# Altium schematic sheet Control_Circuit.SchDoc
size A3; DocumentNumber: 2; SheetNumber: 2; SheetTotal: 3
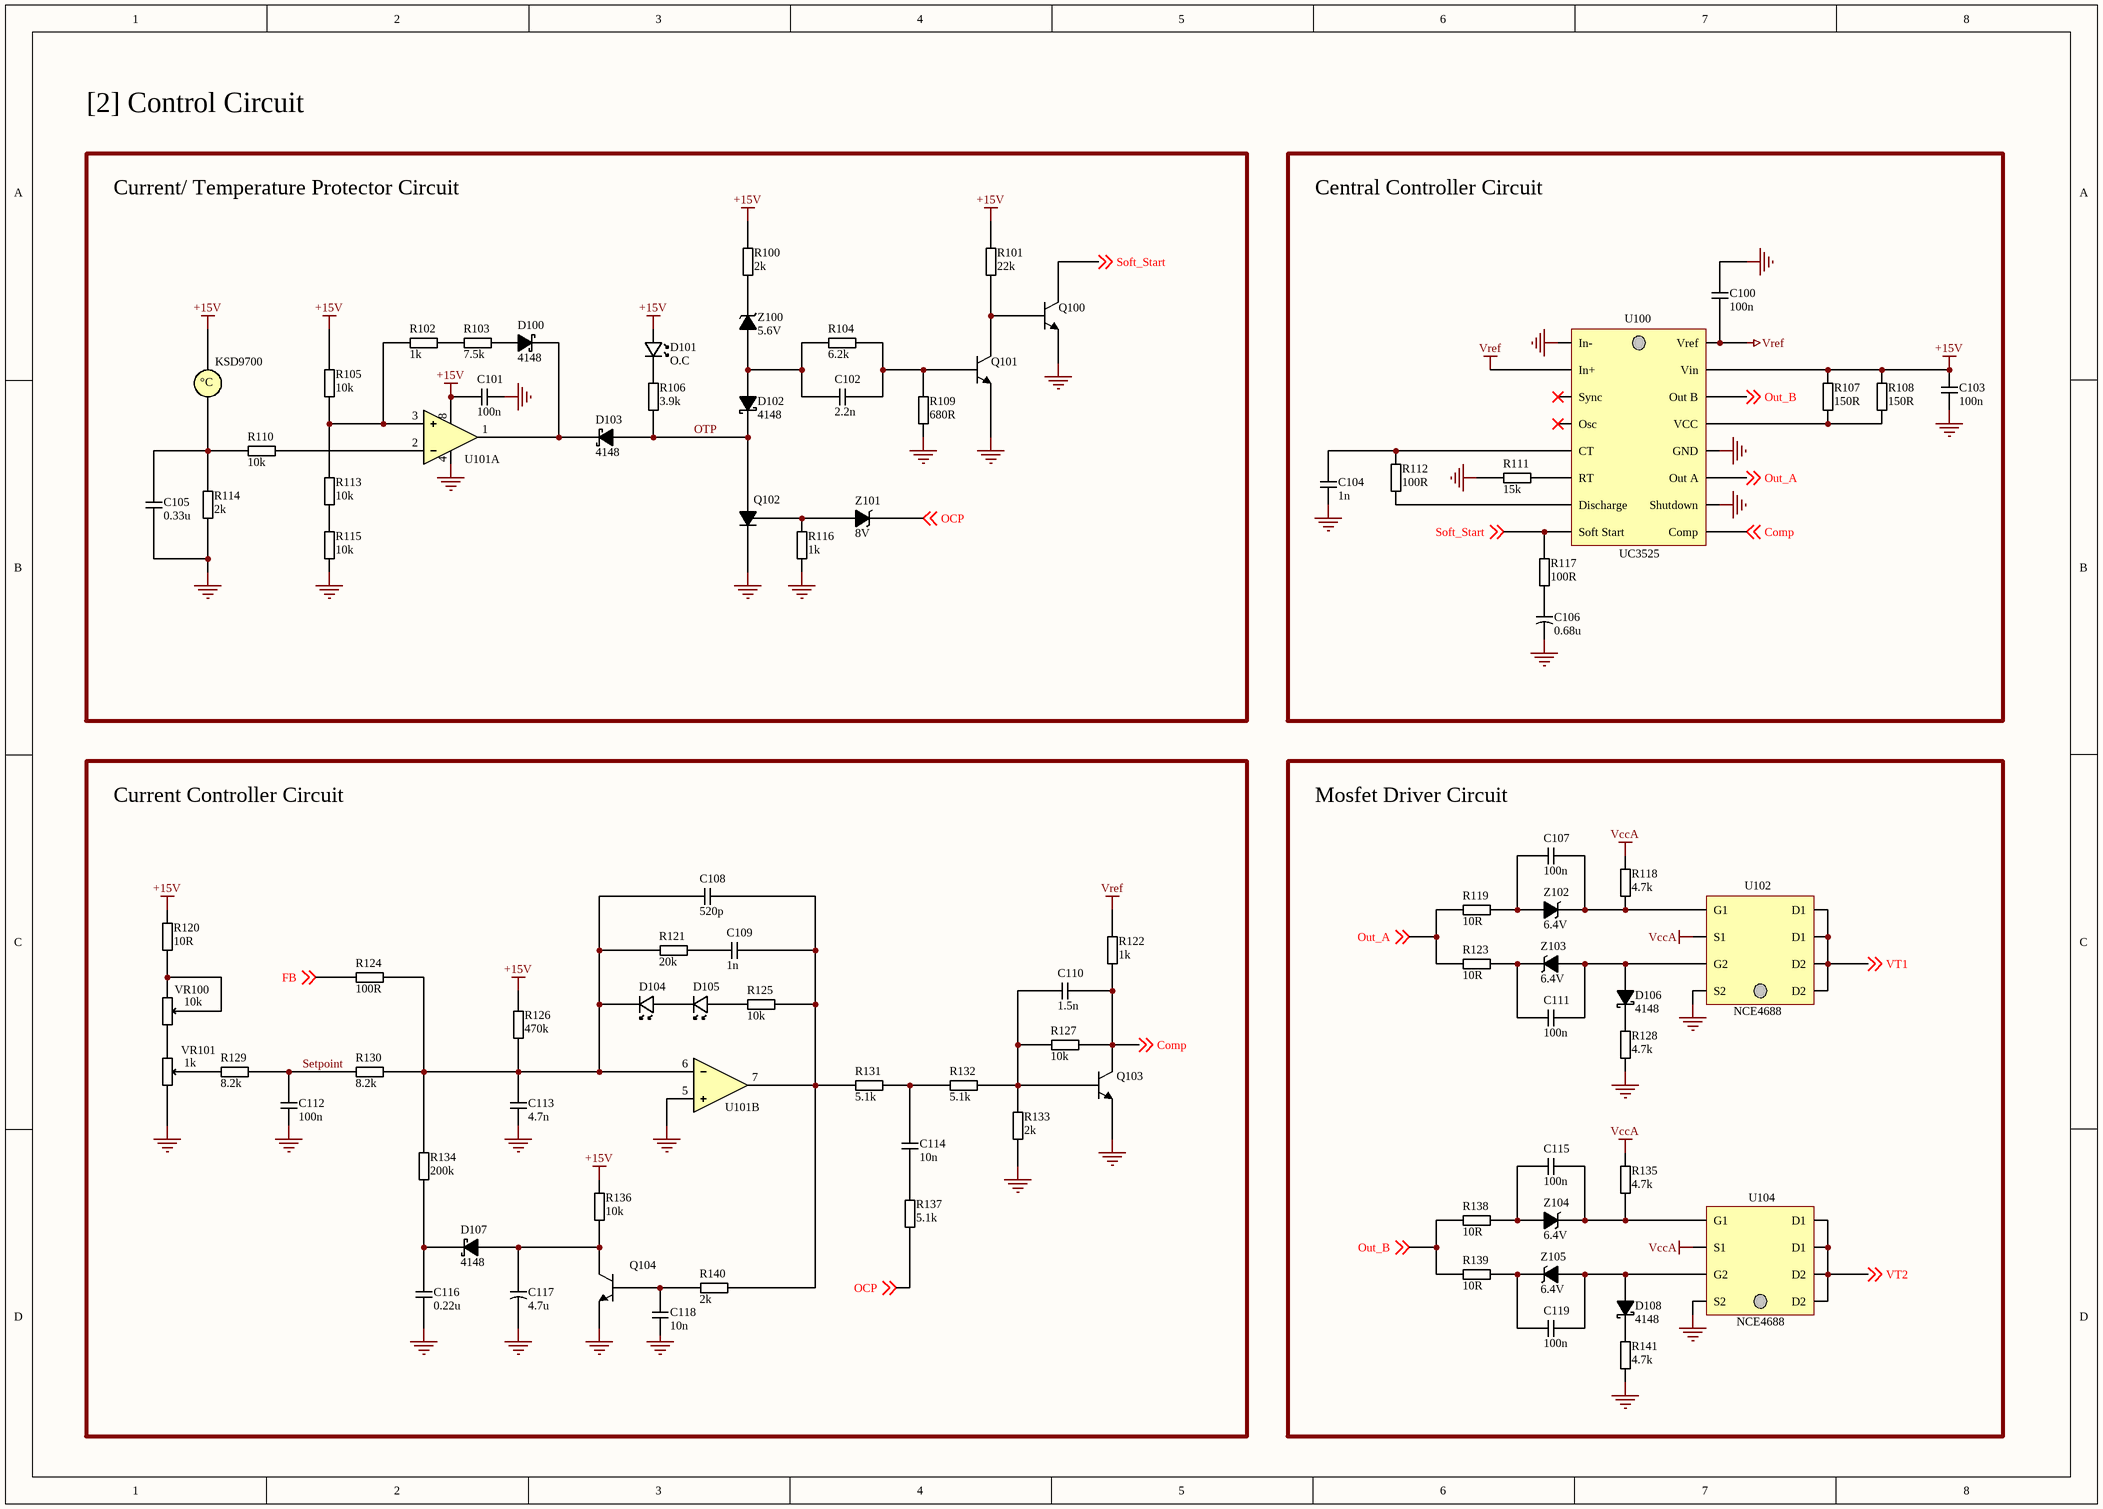
[diagram p0: Control_Circuit.SchDoc]

## Parts
C100  100n  [Cap_SMD_0805]
C101  100n  [Cap_SMD_0805]
C102  2.2n  [Cap_SMD_0805]
C103  100n  [Cap_SMD_0805]
C104  1n  [Cap_SMD_0805]
C105  0.33u  [Cap_SMD_0805]
C106  0.68u  [Cap_THD_Tantalum_2.5mm]
C107  100n  [Cap_SMD_0805]
C108  520p  [Cap_SMD_0805]
C109  1n  [Cap_SMD_0805]
C110  1.5n  [Cap_SMD_0805]
C111  100n  [Cap_SMD_0805]
C112  100n  [Cap_SMD_0805]
C113  4.7n  [Cap_SMD_0805]
C114  10n  [Cap_SMD_0805]
C115  100n  [Cap_SMD_0805]
C116  0.22u  [Cap_SMD_0805]
C117  4.7u  [Cap_THD_Tantalum_2.5mm]
C118  10n  [Cap_SMD_0805]
C119  100n  [Cap_SMD_0805]
D100  4148  [Diode_SMD_4.8mm]
D101  O.C  [Led_SMD_0805]
D102  4148  [Diode_SMD_4.8mm]
D103  4148  [Diode_SMD_4.8mm]
D104  D  [Led_SMD_0805]  (value not drawn)
D105  D  [Led_SMD_0805]  (value not drawn)
D106  4148  [Diode_SMD_4.8mm]
D107  4148  [Diode_SMD_4.8mm]
D108  4148  [Diode_SMD_4.8mm]
K100  KSD9700  [CONN_XH_2P_2.5mm]
Q100  8050  [SOT23 - 2mm]  (value not drawn)
Q101  8050  [SOT23 - 2mm]  (value not drawn)
Q102  MCR100-6  [SOT23 - 2mm]  (value not drawn)
Q103  8050  [SOT23 - 2mm]  (value not drawn)
Q104  8050  [SOT23 - 2mm]  (value not drawn)
R100  2k  [Res_SMD_0805]
R101  22k  [Res_SMD_0805]
R102  1k  [Res_SMD_0805]
R103  7.5k  [Res_SMD_0805]
R104  6.2k  [Res_SMD_0805]
R105  10k  [Res_SMD_0805]
R106  3.9k  [Res_SMD_0805]
R107  150R  [Res_SMD_0805]
R108  150R  [Res_SMD_0805]
R109  680R  [Res_SMD_0805]
R110  10k  [Res_SMD_0805]
R111  15k  [Res_SMD_0805]
R112  100R  [Res_SMD_0805]
R113  10k  [Res_SMD_0805]
R114  2k  [Res_SMD_0805]
R115  10k  [Res_SMD_0805]
R116  1k  [Res_SMD_0805]
R117  100R  [Res_SMD_0805]
R118  4.7k  [Res_SMD_0805]
R119  10R  [Res_SMD_0805]
R120  10R  [Res_SMD_0805]
R121  20k  [Res_SMD_0805]
R122  1k  [Res_SMD_0805]
R123  10R  [Res_SMD_0805]
R124  100R  [Res_SMD_0805]
R125  10k  [Res_SMD_0805]
R126  470k  [Res_SMD_0805]
R127  10k  [Res_SMD_0805]
R128  4.7k  [Res_SMD_0805]
R129  8.2k  [Res_SMD_0805]
R130  8.2k  [Res_SMD_0805]
R131  5.1k  [Res_SMD_0805]
R132  5.1k  [Res_SMD_0805]
R133  2k  [Res_SMD_0805]
R134  200k  [Res_SMD_0805]
R135  4.7k  [Res_SMD_0805]
R136  10k  [Res_SMD_0805]
R137  5.1k  [Res_SMD_0805]
R138  10R  [Res_SMD_0805]
R139  10R  [Res_SMD_0805]
R140  2k  [Res_SMD_0805]
R141  4.7k  [Res_SMD_0805]
U100  UC3525  [SOP16]
U101  OPAMP_LM358_V1  [SOP8]  (value not drawn)  (parts A,B of 2)
U102  NCE4688  [SOP8]
U104  NCE4688  [SOP8]
VR100  10k  [Trimmer_2.54mm]
VR101  1k  [Trimmer_2.54mm]
Z100  5.6V  [Diode_SMD_4.8mm]
Z101  8V  [Diode_SMD_4.8mm]
Z102  6.4V  [Diode_SMD_4.8mm]
Z103  6.4V  [Diode_SMD_4.8mm]
Z104  6.4V  [Diode_SMD_4.8mm]
Z105  6.4V  [Diode_SMD_4.8mm]

## Blocks framed on the sheet
Current/ Temperature Protector Circuit: C101 C102 C105 D100-D103 K100 Q100-Q102 R100-R106 R109 R110 R113-R116 U101 Z100 Z101
Central Controller Circuit: C100 C103 C104 C106 R107 R108 R111 R112 R117 U100
Current Controller Circuit: C108-C110 C112-C114 C116-C118 D104 D105 D107 Q103 Q104 R120-R122 R124-R127 R129-R134 R136 R137 R140 U101 VR100 VR101
Mosfet Driver Circuit: C107 C111 C115 C119 D106 D108 R118 R119 R123 R128 R135 R138 R139 R141 U102 U104 Z102-Z105

## Nets
+15V: C101.2 C103.2 D101.1(A) K100.1 R100.2 R101.2 R105.1 R107.2 R108.2 R120.2 R126.2 R136.2 U100.15(Vin) U101.8(V+)
GND: C100.2 C101.1 C103.1 C104.1 C105.2 C106.2(-) C112.2 C113.2 C116.2 C117.2(-) C118.2 Q100.1(E) Q101.1(E) Q102.2(K) Q103.1(E) Q104.1(E) R109.1 R111.1 R114.1 R115.2 R116.1 R128.2 R133.2 R141.2 U100.1(In-) U100.10(Shutdown) U100.12(GND) U101.4(V-) U101.5(In2+) U102.1(S2) U104.1(S2) VR101.3
VccA: R118.2 R135.1 U102.3(S1) U104.3(S1)
Vref: C100.1 R122.2 U100.2(In+) U100.16(Vref)
Comp: C110.1 Q103.3(C) R122.1 R127.1 U100.9(Comp) ; off-sheet Comp
FB: R124.2 ; off-sheet FB
OCP: R137.1 Z101.2(K) ; off-sheet OCP
OTP: D102.2(K) D103.1(A) Q102.1(A) R106.2
Out_A: R119.1 R123.1 U100.11(Out_A) ; off-sheet Out_A
Out_B: R138.1 R139.1 U100.14(Out_B) ; off-sheet Out_B
Setpoint: C112.1 R129.1 R130.2
Soft_Start: Q100.3(C) R117.2 U100.8(Soft_Start) ; off-sheet Soft_Start
VT1: U102.5(D1) U102.6(D1) U102.7(D2) U102.8(D2) ; off-sheet VT1
VT2: U104.5(D1) U104.6(D1) U104.7(D2) U104.8(D2) ; off-sheet VT2
NetC102_1: C102.1 Q101.2(B) R104.1 R109.2
NetC102_2: C102.2 D102.1(A) R104.2 Z100.1(A)
NetC104_2: C104.2 R112.2 U100.5(CT)
NetC105_1: C105.1 K100.2 R110.1 R114.2
NetC106_1: C106.1(+) R117.1
NetC107_1: C107.1 R118.1 U102.4(G1) Z102.2(K)
NetC107_2: C107.2 R119.2 Z102.1(A)
NetC108_1: C108.1 C109.1 R125.2 R131.1 R140.1 U101.7(Out2)
NetC108_2: C108.2 C113.1 D104.1(K) R121.1 R124.1 R126.1 R130.1 R134.2 U101.6(In2-)
NetC109_2: C109.2 R121.2
NetC110_2: C110.2 Q103.2(B) R127.2 R132.2 R133.1
NetC111_1: C111.1 D106.1(A) U102.2(G2) Z103.1(A)
NetC111_2: C111.2 R123.2 Z103.2(K)
NetC114_1: C114.1 R137.2
NetC114_2: C114.2 R131.2 R132.1
NetC115_1: C115.1 R135.2 U104.4(G1) Z104.2(K)
NetC115_2: C115.2 R138.2 Z104.1(A)
NetC116_1: C116.1 D107.2(K) R134.1
NetC117_1: C117.1(+) D107.1(A) Q104.3(C) R136.1
NetC118_1: C118.1 Q104.2(B) R140.2
NetC119_1: C119.1 D108.1(A) U104.2(G2) Z105.1(A)
NetC119_2: C119.2 R139.2 Z105.2(K)
NetD100_1: D100.1(A) R103.2
NetD100_2: D100.2(K) D103.2(K) U101.1(Out1)
NetD101_2: D101.2(K) R106.1
NetD104_2: D104.2(A) D105.1(K)
NetD105_2: D105.2(A) R125.1
NetD106_2: D106.2(K) R128.1
NetD108_2: D108.2(K) R141.1
NetQ100_2: Q100.2(B) Q101.3(C) R101.1
NetQ102_3: Q102.3(G) R116.2 Z101.1(A)
NetR100_1: R100.1 Z100.2(K)
NetR102_1: R102.1 R105.2 R113.1 U101.3(In1+)
NetR102_2: R102.2 R103.1
NetR107_1: R107.1 R108.1 U100.13(VCC)
NetR110_2: R110.2 U101.2(In1-)
NetR111_2: R111.2 U100.6(RT)
NetR112_1: R112.1 U100.7(Discharge)
NetR113_2: R113.2 R115.1
NetR120_1: R120.1 VR100.1 VR100.2
NetR129_2: R129.2 VR101.2
NetVR100_3: VR100.3 VR101.1

Not connected (* = marked no-connect by the designer): U100 3(Sync)* 4(Osc)*

## Notes on the sheet
- [2] Control Circuit
- (in symbol Relay_KSD9700) °C

## Library data of the parts
C100-C105 C107-C116 C118 C119 = Cap_SMD_0805: 0805 SMD Capacitor
C106 C117 = Cap_THD_Tantalum_2.5mm: Voltage: V
D100 D102 D103 D106-D108 = Diode_Schottky: Schottky Diode
D101 = Diode_LED: Light Emitting Diode - LED
D104 D105 = LED White
K100 = Relay_KSD9700: KSD-9700 series thermal protector
Q100 Q101 Q103 Q104 = BJT_SS8050_V1: Bipolar Transistor BJT NPN Epitaxial Silicon 25V 1500mA 100MHz 1W TO-92-3; Manufacturer: ON Semiconductor / Fairchild; Manufacturer Part Number: SS8050DTA; Max Collector Current: 1.5A; Collector-emitter Voltage-Max: 500mV; hFE Min: 85; Collector Base Voltage (VCBO): 40V; Emitter Base Voltage (VEBO): 6V; Supplier 1: Future Electronics; RoHS: Yes; Category: BJTs; Stock 1: 10000; Pricing 1: 2000=0.0536, 6000=0.0516, 20000=0.0496, 40000=0.0484, 80000=0.0463 (USD); Mount: Through Hole; Case/Package: TO-92-3; Number of Pins: 3; Weight: 0.24g; Min Operating Temperature: -65°C; Max Operating Temperature: 150°C; Packaging: Ammo Pack; Series: -; Package Quantity: 2000; Max Power Dissipation: 1W; Transition Frequency: 100MHz; Collector Emitter Breakdown Voltage: 25V; Polarity: NPN; Collector Emitter Saturation Voltage: 500mV; Gain Bandwidth Product: 100MHz; Voltage Rating (DC): 25V; Collector Emitter Voltage (VCEO): 25V; Max Breakdown Voltage: 25V; Current Rating: 1.5A; Length: 4.58mm; Width: 3.86mm; Height: 4.58mm; Radiation Hardening: No; RoHS Compliant: Yes; Lead Free: Lead Free; Reach SVHC Compliant: No; ComponentLink1URL: https://datasheet.ciiva.com/4721/ss8050-117753-4721333.pdf?src-supplier=Mouser; ComponentLink1Description: https://datasheet.ciiva.com/4721/ss8050-117753-4721333.pdf?src-supplier=Mouser; ComponentLink2URL: https://datasheet.ciiva.com/11207/ss8050-11207512.pdf?src-supplier=Avnet; ComponentLink2Description: https://datasheet.ciiva.com/11207/ss8050-11207512.pdf?src-supplier=Avnet; ComponentLink3URL: https://datasheet.ciiva.com/18648/ss8050-18648133.pdf?src-supplier=Digi-Key; ComponentLink3Description: https://datasheet.ciiva.com/18648/ss8050-18648133.pdf?src-supplier=Digi-Key; ComponentLink4URL: https://datasheet.ciiva.com/17447/ss8050-17447834.pdf?src-supplier=Future+Electronics; ComponentLink4Description: https://datasheet.ciiva.com/17447/ss8050-17447834.pdf?src-supplier=Future+Electronics; ComponentLink5URL: https://datasheet.ciiva.com/46415/1868828-46415608.pdf?src-supplier=Element14; ComponentLink5Description: https://datasheet.ciiva.com/46415/1868828-46415608.pdf?src-supplier=Element14; Supplier Part Number 1: 7178421
Q102 = SCR_MCR100_6_V1: Thyristor SCR 400V 10A 3-Pin TO-92 Tape and Ammo; Manufacturer: ON Semiconductor; Manufacturer Part Number: MCR100-6ZL1G; Hold Current: 5mA; Current Rating: 800mA; Supplier 1: Avnet; RoHS: Yes; Category: SCRs; Stock 1: 1846; Case/Package: TO-92-3; Number of Pins: 3; Min Operating Temperature: -40°C; Max Operating Temperature: 110°C; Voltage Rating (DC): 400V; Packaging: Tape and Reel; Series: -; Package Quantity: 2000; RMS Current (Irms): 800mA; Max Repetitive Reverse Voltage (Vrrm): 400V; Radiation Hardening: No; RoHS Compliant: Yes; Lead Free: Lead Free; ComponentLink1URL: https://datasheet.ciiva.com/3054/mcr100-d-3054696.pdf?src-supplier=Avnet; ComponentLink1Description: https://datasheet.ciiva.com/3054/mcr100-d-3054696.pdf?src-supplier=Avnet; ComponentLink2URL: https://datasheet.ciiva.com/6366/mcr100-d-6366847.pdf?src-supplier=Digi-Key; ComponentLink2Description: https://datasheet.ciiva.com/6366/mcr100-d-6366847.pdf?src-supplier=Digi-Key; ComponentLink3URL: https://datasheet.ciiva.com/16453/mcr100-d-16453261.pdf?src-supplier=Future+Electronics; ComponentLink3Description: https://datasheet.ciiva.com/16453/mcr100-d-16453261.pdf?src-supplier=Future+Electronics; Supplier Part Number 1: MCR100-6ZL1G
R100-R141 = Res_SMD_0805: 0805 SMD Resistor
U100 = PMIC_UC3525: Enhanced 35V, Dual 0.4A 400KHz PWM controller with Low output when off, 0C to 70C 16-PDIP 0 to 70; Manufacturer: Texas Instruments; Manufacturer Part Number: UC3525BN; Output Current: 400mA; Rise Time: 100ns; Number of Outputs: 2; Max Duty Cycle: 49%; Fall Time: 50ns; Topology: Flyback,Push-Pull; Output Voltage: 18V; Output Configuration: Positive; Number of Output Phases: 1; Synchronous Rectifier: Yes; Quiescent Current: 14mA; Supplier 1: Mouser; RoHS: Yes; Category: Voltage Regulators - Switching; Stock 1: 185; Pricing 1: 1=6.72, 10=6.42, 50=5.45, 100=5.2, 1000=4.31, 10000=4.31 (USD); Case/Package: N; Number of Pins: 16; Weight: 0.037172oz; Min Operating Temperature: 0°C; Max Operating Temperature: 70°C; Packaging: Rail/Tube; Switching Frequency: 400kHz; Series: -; Max Supply Voltage: 35V; Duty Cycle: 49%; Clock Sync: Yes; Radiation Hardening: No; Lead Free: Lead Free; RoHS Compliant: Yes; ComponentLink1URL: https://datasheet.ciiva.com/15108/getdatasheetpartid-189083-15108224.pdf?src-supplier=Verical; ComponentLink1Description: https://datasheet.ciiva.com/15108/getdatasheetpartid-189083-15108224.pdf?src-supplier=Verical; ComponentLink2URL: https://datasheet.ciiva.com/2016/uc2525b-2016182.pdf?src-supplier=Digi-Key; ComponentLink2Description: https://datasheet.ciiva.com/2016/uc2525b-2016182.pdf?src-supplier=Digi-Key; ComponentLink3URL: https://datasheet.ciiva.com/14250/slus376-14250904.pdf?src-supplier=Avnet; ComponentLink3Description: https://datasheet.ciiva.com/14250/slus376-14250904.pdf?src-supplier=Avnet; Supplier Part Number 1: 595-UC3525BN
U102 U104 = PMIC_NCE4688: Mosfet Gate Driver
VR100 VR101 = Trimmer
Z100-Z105 = Diode_Zener: Zener Diode